# Altium schematic sheet Input.SchDoc
size A4; SheetNumber: 2; SheetTotal: 3
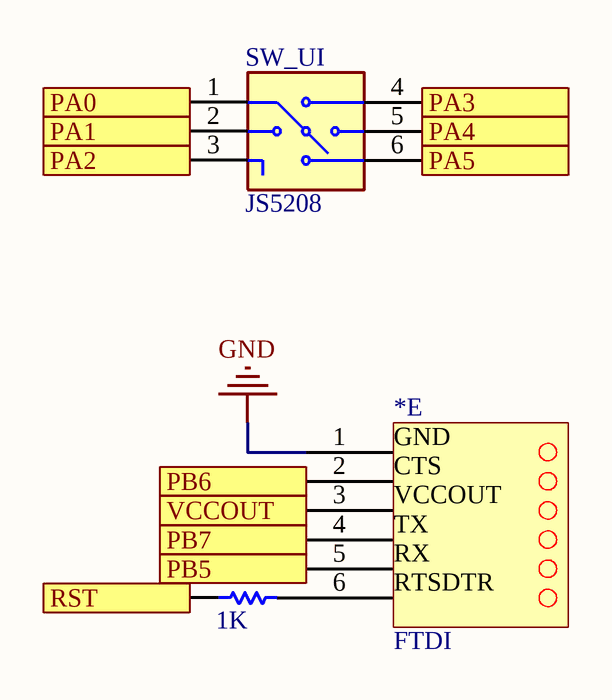
[diagram p0: Input.SchDoc]

## Parts
*  FTDI  (part E of 5)
R?  value 1K  (hidden comment: Resistor)
SW_UI  JS5208  [SW_JS5208]

## Ports
PA0 (out), PA1 (out), PA2 (out), PA3 (out), PA4 (out), PA5 (out), PB5 (in), PB6 (out), PB7 (out), RST (out), VCCOUT (in)

## Nets
PA0: SW_UI.1 ; port PA0
PA1: SW_UI.2 ; port PA1
PA2: SW_UI.3 ; port PA2
PA3: SW_UI.4 ; port PA3
PA4: SW_UI.5 ; port PA4
PA5: SW_UI.6 ; port PA5
RST: R?.1 ; port RST

Not connected (* = marked no-connect by the designer): * 1 2 3 4 5 6; R? 2

## Notes on the sheet
- (in symbol Component_1, part E) GND; CTS; VCCOUT; TX; RX; RTSDTR

## Library data of the parts
* = Component_1
R? = Resistor: TC1: 0; SimulationGenericComponent: True; TC2: 0
SW_UI = JS5208: MP: JS5208; Availability: Unavailable; Package: None; Price: None; Value: *